# EAGLE design untitled (EAGLE 8.2.2)
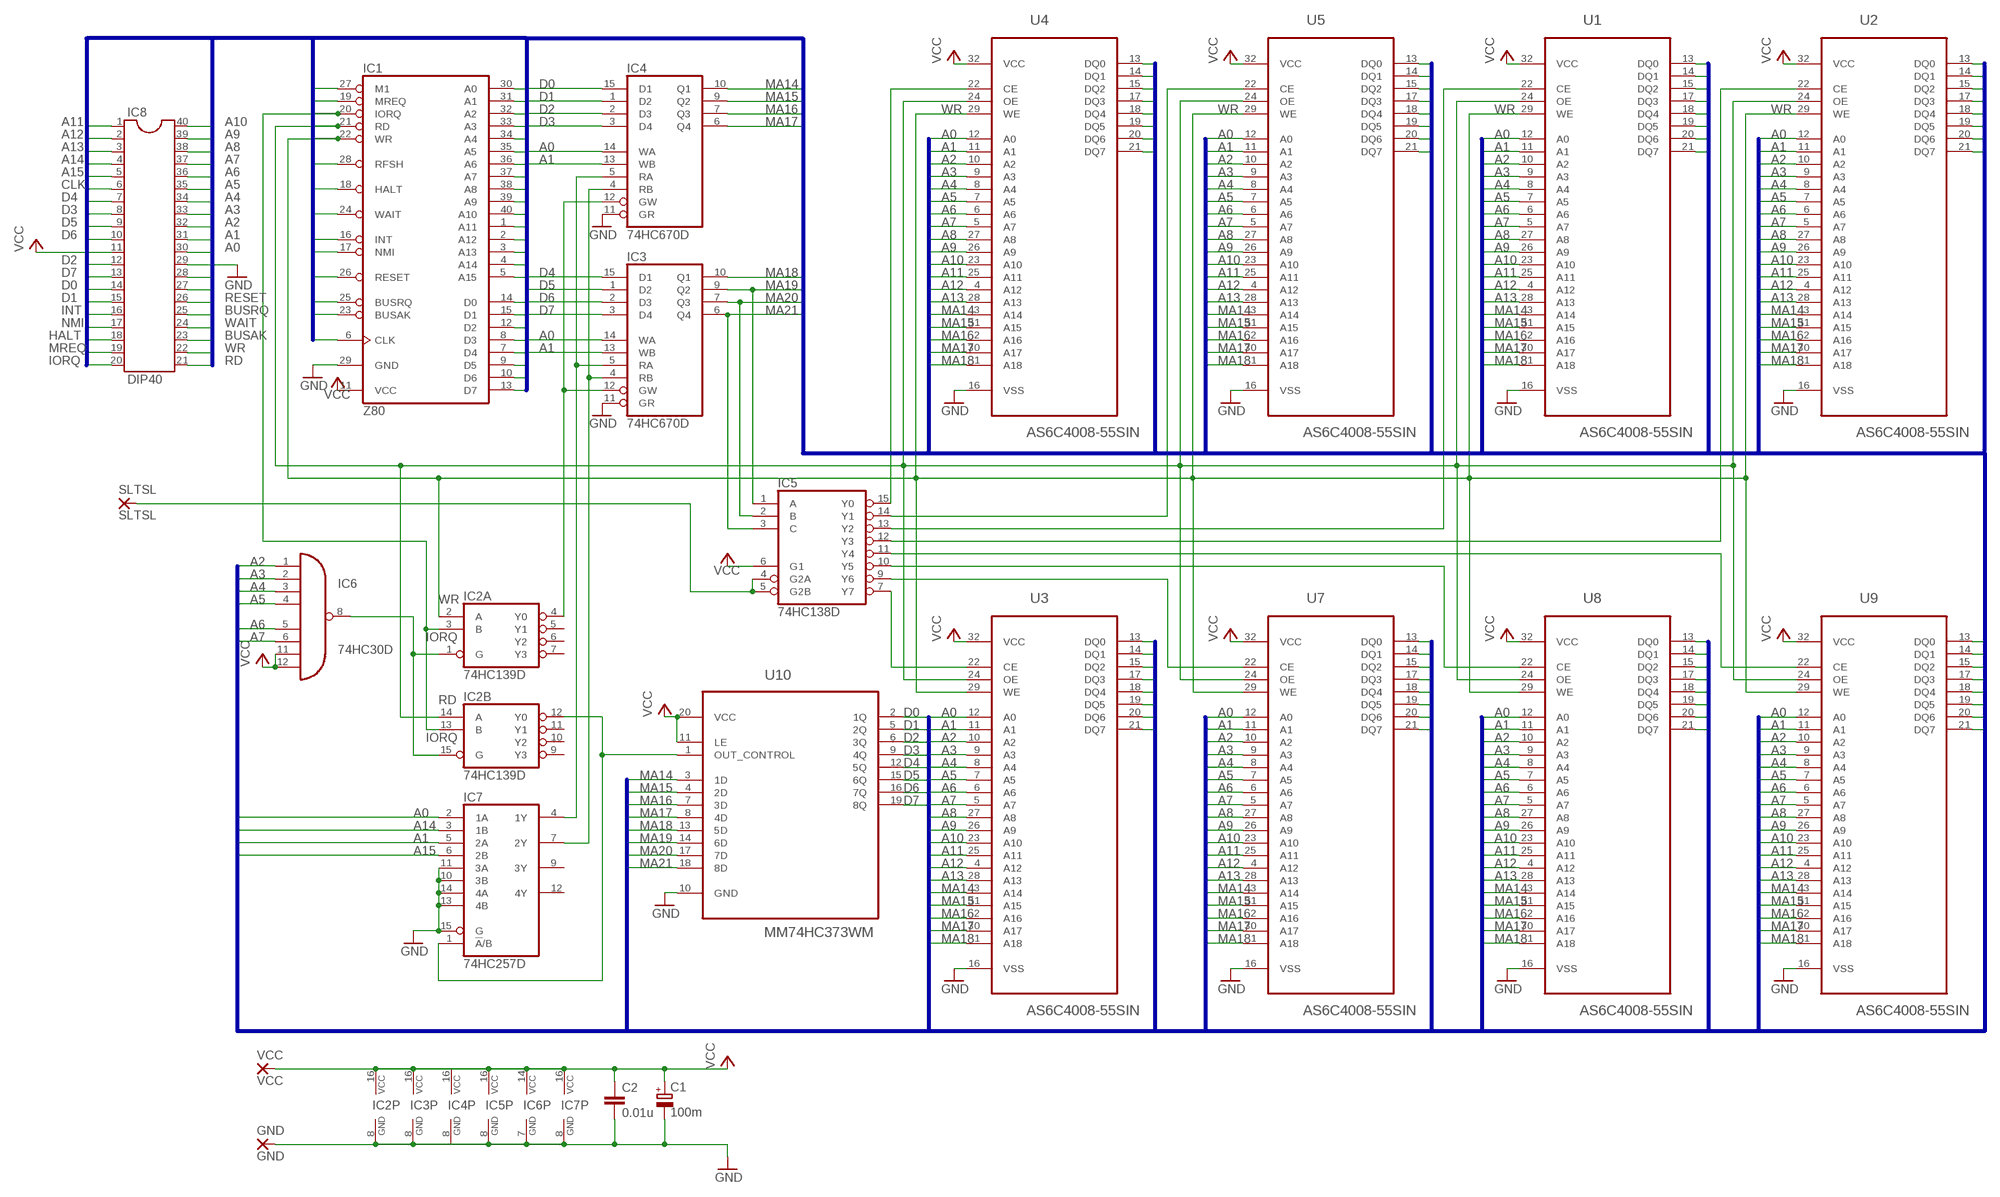
[diagram p0: schematic, sheet 1]

## Parts
C1  100m  CPOL-EUE2.5-5  [E2,5-5]
C2  0.01u  C2.5/2  [C2.5-2]
GND  GND  WIREPAD1,6/0,8  [1,6/0,8]
IC1  Z80  Z80CPU  [DIL40]
IC2  74HC139D  [SO16]
IC3  74HC670D  [SO16]
IC4  74HC670D  [SO16]
IC5  74HC138D  [SO16]
IC6  74HC30D  [SO14]
IC7  74HC257D  [SO16]
IC8  DIP40  DIL40  [DIL40]
SLTSL  SLTSL  WIREPAD1,6/0,8  [1,6/0,8]
U1  AS6C4008-55SIN  [SOIC127P1407X299-32N]
U2  AS6C4008-55SIN  [SOIC127P1407X299-32N]
U3  AS6C4008-55SIN  [SOIC127P1407X299-32N]
U4  AS6C4008-55SIN  [SOIC127P1407X299-32N]
U5  AS6C4008-55SIN  [SOIC127P1407X299-32N]
U7  AS6C4008-55SIN  [SOIC127P1407X299-32N]
U8  AS6C4008-55SIN  [SOIC127P1407X299-32N]
U9  AS6C4008-55SIN  [SOIC127P1407X299-32N]
U10  MM74HC373WM  [SOIC127P1032X265-20N]
VCC  VCC  WIREPAD1,6/0,8  [1,6/0,8]

## Nets
A0: IC1.30(A0) IC3.14(WA) IC4.14(WA) IC7.2(1A) IC8.30 U1.12(A0) U2.12(A0) U3.12(A0) U4.12(A0) U5.12(A0) U7.12(A0) U8.12(A0) U9.12(A0)
A1: IC1.31(A1) IC3.13(WB) IC4.13(WB) IC7.5(2A) IC8.31 U1.11(A1) U2.11(A1) U3.11(A1) U4.11(A1) U5.11(A1) U7.11(A1) U8.11(A1) U9.11(A1)
A2: IC1.32(A2) IC6.1(I0) IC8.32 U1.10(A2) U2.10(A2) U3.10(A2) U4.10(A2) U5.10(A2) U7.10(A2) U8.10(A2) U9.10(A2)
A3: IC1.33(A3) IC6.2(I1) IC8.33 U1.9(A3) U2.9(A3) U3.9(A3) U4.9(A3) U5.9(A3) U7.9(A3) U8.9(A3) U9.9(A3)
A4: IC1.34(A4) IC6.3(I2) IC8.34 U1.8(A4) U2.8(A4) U3.8(A4) U4.8(A4) U5.8(A4) U7.8(A4) U8.8(A4) U9.8(A4)
A5: IC1.35(A5) IC6.4(I3) IC8.35 U1.7(A5) U2.7(A5) U3.7(A5) U4.7(A5) U5.7(A5) U7.7(A5) U8.7(A5) U9.7(A5)
A6: IC1.36(A6) IC6.5(I4) IC8.36 U1.6(A6) U2.6(A6) U3.6(A6) U4.6(A6) U5.6(A6) U7.6(A6) U8.6(A6) U9.6(A6)
A7: IC1.37(A7) IC6.6(I5) IC8.37 U1.5(A7) U2.5(A7) U3.5(A7) U4.5(A7) U5.5(A7) U7.5(A7) U8.5(A7) U9.5(A7)
A8: IC1.38(A8) IC8.38 U1.27(A8) U2.27(A8) U3.27(A8) U4.27(A8) U5.27(A8) U7.27(A8) U8.27(A8) U9.27(A8)
A9: IC1.39(A9) IC8.39 U1.26(A9) U2.26(A9) U3.26(A9) U4.26(A9) U5.26(A9) U7.26(A9) U8.26(A9) U9.26(A9)
A10: IC1.40(A10) IC8.40 U1.23(A10) U2.23(A10) U3.23(A10) U4.23(A10) U5.23(A10) U7.23(A10) U8.23(A10) U9.23(A10)
A11: IC1.1(A11) IC8.1 U1.25(A11) U2.25(A11) U3.25(A11) U4.25(A11) U5.25(A11) U7.25(A11) U8.25(A11) U9.25(A11)
A12: IC1.2(A12) IC8.2 U1.4(A12) U2.4(A12) U3.4(A12) U4.4(A12) U5.4(A12) U7.4(A12) U8.4(A12) U9.4(A12)
A13: IC1.3(A13) IC8.3 U1.28(A13) U2.28(A13) U3.28(A13) U4.28(A13) U5.28(A13) U7.28(A13) U8.28(A13) U9.28(A13)
A14: IC1.4(A14) IC7.3(1B) IC8.4
A15: IC1.5(A15) IC7.6(2B) IC8.5
BUSAK: IC1.23(BUSAK) IC8.23
BUSRQ: IC1.25(BUSRQ) IC8.25
CLK: IC1.6(CLK) IC8.6
D0: IC1.14(D0) IC4.15(D1) IC8.14 U1.13(DQ0) U2.13(DQ0) U3.13(DQ0) U4.13(DQ0) U5.13(DQ0) U7.13(DQ0) U8.13(DQ0) U9.13(DQ0) U10.2(1Q)
D1: IC1.15(D1) IC4.1(D2) IC8.15 U1.14(DQ1) U2.14(DQ1) U3.14(DQ1) U4.14(DQ1) U5.14(DQ1) U7.14(DQ1) U8.14(DQ1) U9.14(DQ1) U10.5(2Q)
D2: IC1.12(D2) IC4.2(D3) IC8.12 U1.15(DQ2) U2.15(DQ2) U3.15(DQ2) U4.15(DQ2) U5.15(DQ2) U7.15(DQ2) U8.15(DQ2) U9.15(DQ2) U10.6(3Q)
D3: IC1.8(D3) IC4.3(D4) IC8.8 U1.17(DQ3) U2.17(DQ3) U3.17(DQ3) U4.17(DQ3) U5.17(DQ3) U7.17(DQ3) U8.17(DQ3) U9.17(DQ3) U10.9(4Q)
D4: IC1.7(D4) IC3.15(D1) IC8.7 U1.18(DQ4) U2.18(DQ4) U3.18(DQ4) U4.18(DQ4) U5.18(DQ4) U7.18(DQ4) U8.18(DQ4) U9.18(DQ4) U10.12(5Q)
D5: IC1.9(D5) IC3.1(D2) IC8.9 U1.19(DQ5) U2.19(DQ5) U3.19(DQ5) U4.19(DQ5) U5.19(DQ5) U7.19(DQ5) U8.19(DQ5) U9.19(DQ5) U10.15(6Q)
D6: IC1.10(D6) IC3.2(D3) IC8.10 U1.20(DQ6) U2.20(DQ6) U3.20(DQ6) U4.20(DQ6) U5.20(DQ6) U7.20(DQ6) U8.20(DQ6) U9.20(DQ6) U10.16(7Q)
D7: IC1.13(D7) IC3.3(D4) IC8.13 U1.21(DQ7) U2.21(DQ7) U3.21(DQ7) U4.21(DQ7) U5.21(DQ7) U7.21(DQ7) U8.21(DQ7) U9.21(DQ7) U10.19(8Q)
GND [vcc]: C1.- C2.2 GND.1(P) IC1.29(GND) IC2.8(P:GND) IC3.8(GND) IC3.11(GR) IC4.8(GND) IC4.11(GR) IC5.8(GND) IC6.7(GND) IC7.8(GND) IC7.10(3B) IC7.11(3A) IC7.13(4B) IC7.14(4A) IC7.15(G) IC8.29 U1.16(VSS) U2.16(VSS) U3.16(VSS) U4.16(VSS) U5.16(VSS) U7.16(VSS) U8.16(VSS) U9.16(VSS) U10.10(GND)
HALT: IC1.18(HALT) IC8.18
INT: IC1.16(INT) IC8.16
IORQ: IC1.20(IORQ) IC2.3(A:B) IC2.13(B:B) IC8.20
M1: IC1.27(M1) IC8.27
MA14: IC4.10(Q1) U1.3(A14) U2.3(A14) U3.3(A14) U4.3(A14) U5.3(A14) U7.3(A14) U8.3(A14) U9.3(A14) U10.3(1D)
MA15: IC4.9(Q2) U1.31(A15) U2.31(A15) U3.31(A15) U4.31(A15) U5.31(A15) U7.31(A15) U8.31(A15) U9.31(A15) U10.4(2D)
MA16: IC4.7(Q3) U1.2(A16) U2.2(A16) U3.2(A16) U4.2(A16) U5.2(A16) U7.2(A16) U8.2(A16) U9.2(A16) U10.7(3D)
MA17: IC4.6(Q4) U1.30(A17) U2.30(A17) U3.30(A17) U4.30(A17) U5.30(A17) U7.30(A17) U8.30(A17) U9.30(A17) U10.8(4D)
MA18: IC3.10(Q1) U1.1(A18) U2.1(A18) U3.1(A18) U4.1(A18) U5.1(A18) U7.1(A18) U8.1(A18) U9.1(A18) U10.13(5D)
MA19: IC3.9(Q2) IC5.1(A) U10.14(6D)
MA20: IC3.7(Q3) IC5.2(B) U10.17(7D)
MA21: IC3.6(Q4) IC5.3(C) U10.18(8D)
MREQ: IC1.19(MREQ) IC8.19
N$1: IC2.12(B:Y0) IC7.1(!A!/B) U10.1(OUT_CONTROL)
N$2: IC5.13(Y2) U1.22(CE)
N$3: IC5.12(Y3) U2.22(CE)
N$4: IC3.5(RA) IC4.5(RA) IC7.4(1Y)
N$5: IC5.15(Y0) U4.22(CE)
N$6: IC5.14(Y1) U5.22(CE)
N$7: IC3.4(RB) IC4.4(RB) IC7.7(2Y)
N$8: IC5.11(Y4) U9.22(CE)
N$9: IC2.1(A:G) IC2.15(B:G) IC6.8(O)
N$10: IC5.10(Y5) U8.22(CE)
N$11: IC5.9(Y6) U7.22(CE)
N$12: IC2.4(A:Y0) IC3.12(GW) IC4.12(GW)
N$13: IC5.4(G2A) IC5.5(G2B) SLTSL.1(P)
N$14: IC5.7(Y7) U3.22(CE)
NMI: IC1.17(NMI) IC8.17
RD: IC1.21(RD) IC2.14(B:A) IC8.21 U1.24(OE) U2.24(OE) U3.24(OE) U4.24(OE) U5.24(OE) U7.24(OE) U8.24(OE) U9.24(OE)
RESET: IC1.26(RESET) IC8.26
RFSH: IC1.28(RFSH) IC8.28
VCC [vcc]: C1.+ C2.1 IC1.11(VCC) IC2.16(P:VCC) IC3.16(VCC) IC4.16(VCC) IC5.6(G1) IC5.16(VCC) IC6.11(I6) IC6.12(I7) IC6.14(VCC) IC7.16(VCC) IC8.11 U1.32(VCC) U2.32(VCC) U3.32(VCC) U4.32(VCC) U5.32(VCC) U7.32(VCC) U8.32(VCC) U9.32(VCC) U10.11(LE) U10.20(VCC) VCC.1(P)
WAIT: IC1.24(WAIT) IC8.24
WR: IC1.22(WR) IC2.2(A:A) IC8.22 U1.29(WE) U2.29(WE) U3.29(WE) U4.29(WE) U5.29(WE) U7.29(WE) U8.29(WE) U9.29(WE)
Unconnected: IC2.5(A:Y1) IC2.6(A:Y2) IC2.7(A:Y3) IC2.9(B:Y3) IC2.10(B:Y2) IC2.11(B:Y1) IC7.9(3Y) IC7.12(4Y)

## Buses
B$2,A[0..15],MA[14..21],D[0..7],M1,MREQ,IORQ,RD,WR,RFSH,HALT,WAIT,INT,NMI,RESET,BUSRQ,BUSAK,CLK

## Library data of the parts
C1 = resistor:CPOL-EU: POLARIZED CAPACITOR, European symbol
C2 = capacitor-wima:C: CAPACITOR naming: grid - package width
GND SLTSL VCC = wirepad:WIREPAD: Wire PAD connect wire on PCB
IC1 = zilog:Z80CPU: Z80 FAMILY DEVICE
IC2 = 74xx-eu:74*139: Dual 2-line to 4-line DECODER/DEMULTIPLEXER
IC3 IC4 = 74xx-eu:74*670: 4 by 4 REGISTER FILES, 3-state
IC5 = 74xx-eu:74*138: 3-line to 8-line DECODER/DEMULTIPLEXER
IC6 = 74xx-eu:74*30: 8-input NAND gate
IC7 = 74xx-eu:74*257: Quadruple 2-to 1 line data SELECTOR/MULTIPLEXER
IC8 = ic-package:DIL40: Dual In Line
U1-U5 U7-U9 = Alliance_Memory_By_element14_Batch_1:AS6C4008-55SIN: CMOS SRAM; MPN: AS6C4008-55SIN; OC_FARNELL: 1562901; OC_NEWARK: 94M6218; PACKAGE: SO-32; SUPPLIER: ALLIANCE MEMORY
U10 = Fairchild_By_element14_Batch_1:MM74HC373WM: 3-STATE Octal D-Type Latch; MPN: MM74HC373WM; OC_FARNELL: 1013976; OC_NEWARK: 78K6072; PACKAGE: SOIC-20; SUPPLIER: Fairchild

## Net classes
1 vcc: width 0.6 mm

## Board
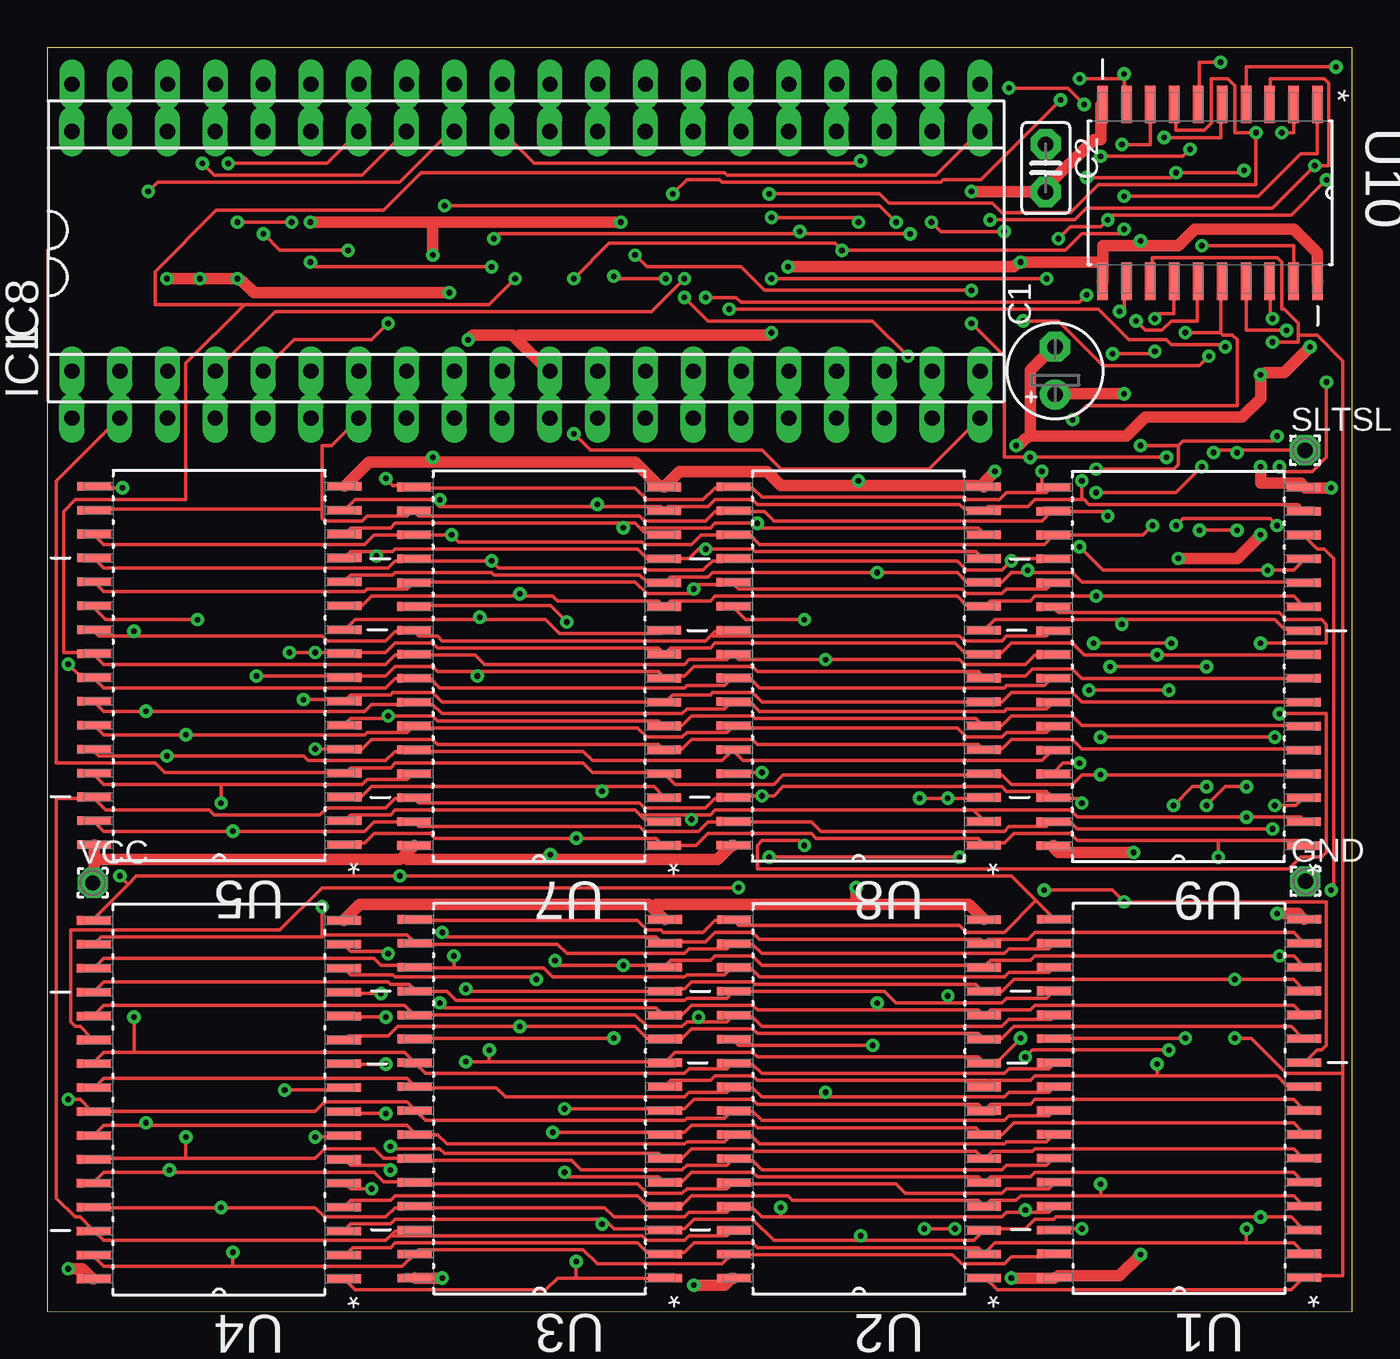
[diagram p1: board, top side]
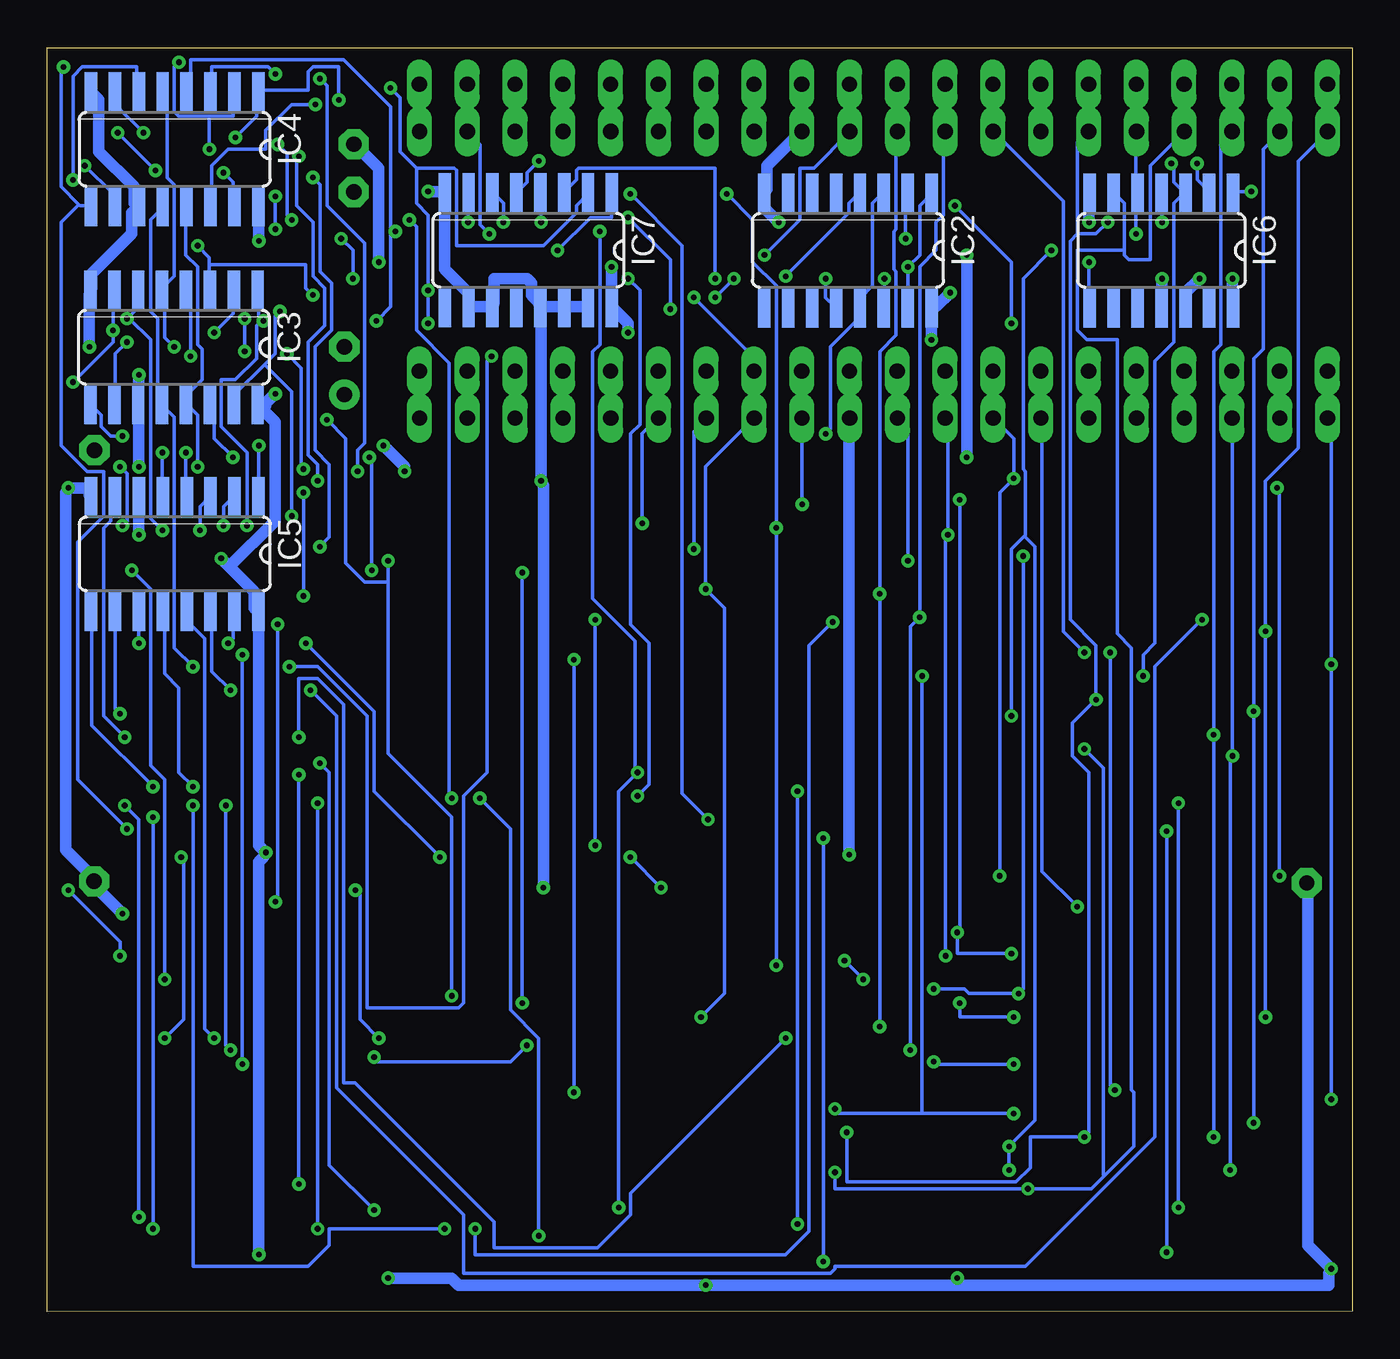
[diagram p2: board, bottom side, seen from below]

Size 69.38 x 67.19 mm. Coordinates in mm from the lower left corner, seen from the top.
Outline: 0.01,0.04 69.38,0 69.36,67.19 0,67.19 0.01,0.04
Copper layers (1*16): Top 0.035mm / dielectric 1.5mm / Bottom 0.035mm
Design rules "default *": minimum track width 7mil, minimum drill 0.3mm, track to track 7mil, track to pad 7mil, pad to pad 7mil, via to via 7mil, smd to smd 7mil, copper to edge 0.4mm, drill to drill 8mil, minimum pad ring 10mil, minimum via ring 8mil, stop-mask expansion 4mil, vias tented up to drill 0mil, thermal gap 10mil

### Footprints (pad centres in the part's own frame; a part is rotated, then mirrored left to right if it is on the bottom)
E2,5-5 = drill 0.813 pad 1.6: + -1.27,0 | drill 0.813 pad 1.6 octagon: - 1.27,0
C2.5-2 = drill 0.813 pad 1.6 octagon: 1 -1.27,0; 2 1.27,0
1,6/0,8 = drill 0.813 pad 1.6 octagon: 1 0,0
DIL40 = drill 0.813 long: 1 -24.13,-7.62; 2 -21.59,-7.62; 3 -19.05,-7.62; 4 -16.51,-7.62; 5 -13.97,-7.62; 6 -11.43,-7.62; 7 -8.89,-7.62; 8 -6.35,-7.62; 9 -3.81,-7.62; 10 -1.27,-7.62; 11 1.27,-7.62; 12 3.81,-7.62; 13 6.35,-7.62; 14 8.89,-7.62; 15 11.43,-7.62; 16 13.97,-7.62; 17 16.51,-7.62; 18 19.05,-7.62; 19 21.59,-7.62; 20 24.13,-7.62; 21 24.13,7.62; 22 21.59,7.62; 23 19.05,7.62; 24 16.51,7.62; 25 13.97,7.62; 26 11.43,7.62; 27 8.89,7.62; 28 6.35,7.62; 29 3.81,7.62; 30 1.27,7.62; 31 -1.27,7.62; 32 -3.81,7.62; 33 -6.35,7.62; 34 -8.89,7.62; 35 -11.43,7.62; 36 -13.97,7.62; 37 -16.51,7.62; 38 -19.05,7.62; 39 -21.59,7.62; 40 -24.13,7.62
SO16 = smd 0.66 x 2.032: 1 -4.445,-3.073; 2 -3.175,-3.073; 3 -1.905,-3.073; 4 -0.635,-3.073; 5 0.635,-3.073; 6 1.905,-3.073; 7 3.175,-3.073; 8 4.445,-3.073; 9 4.445,3.073; 10 3.175,3.073; 11 1.905,3.073; 12 0.635,3.073; 13 -0.635,3.073; 14 -1.905,3.073; 15 -3.175,3.073; 16 -4.445,3.073
SO14 = smd 0.66 x 2.032: 1 -3.81,-3.073; 2 -2.54,-3.073; 3 -1.27,-3.073; 4 0,-3.073; 5 1.27,-3.073; 6 2.54,-3.073; 7 3.81,-3.073; 8 3.81,3.073; 9 2.54,3.073; 10 1.27,3.073; 11 0,3.073; 12 -1.27,3.073; 13 -2.54,3.073; 14 -3.81,3.073
SOIC127P1407X299-32N = smd 1.803 x 0.457: 1 -6.655,9.525; 2 -6.655,8.255; 3 -6.655,6.985; 4 -6.655,5.715; 5 -6.655,4.445; 6 -6.655,3.175; 7 -6.655,1.905; 8 -6.655,0.635; 9 -6.655,-0.635; 10 -6.655,-1.905; 11 -6.655,-3.175; 12 -6.655,-4.445; 13 -6.655,-5.715; 14 -6.655,-6.985; 15 -6.655,-8.255; 16 -6.655,-9.525; 17 6.655,-9.525; 18 6.655,-8.255; 19 6.655,-6.985; 20 6.655,-5.715; 21 6.655,-4.445; 22 6.655,-3.175; 23 6.655,-1.905; 24 6.655,-0.635; 25 6.655,0.635; 26 6.655,1.905; 27 6.655,3.175; 28 6.655,4.445; 29 6.655,5.715; 30 6.655,6.985; 31 6.655,8.255; 32 6.655,9.525
SOIC127P1032X265-20N = smd 1.981 x 0.559: 1 -4.699,5.715; 2 -4.699,4.445; 3 -4.699,3.175; 4 -4.699,1.905; 5 -4.699,0.635; 6 -4.699,-0.635; 7 -4.699,-1.905; 8 -4.699,-3.175; 9 -4.699,-4.445; 10 -4.699,-5.715; 11 4.699,-5.715; 12 4.699,-4.445; 13 4.699,-3.175; 14 4.699,-1.905; 15 4.699,-0.635; 16 4.699,0.635; 17 4.699,1.905; 18 4.699,3.175; 19 4.699,4.445; 20 4.699,5.715

### Placement (x,y rotation side)
C1  53.58,50.02 90 top
C2  53.08,60.79 270 top
GND  66.88,22.88 0 top
IC1  25.45,55.12 0 top
IC2  26.81,56.41 180 bottom
IC3  62.63,51.26 180 bottom
IC4  62.6,61.78 180 bottom
IC5  62.59,40.28 180 bottom
IC6  10.15,56.41 180 bottom
IC7  43.8,56.42 180 bottom
IC8  25.46,57.62 0 top
SLTSL  66.86,45.79 0 top
U1  60.17,11.34 180 top
U2  43.15,11.32 180 top
U3  26.18,11.33 180 top
U4  9.14,11.28 180 top
U5  9.15,34.35 180 top
U7  26.15,34.31 180 top
U8  43.13,34.32 180 top
U9  60.13,34.3 180 top
U10  61.81,59.47 270 top
VCC  2.43,22.79 0 top

### Tracks (layer width: path | path; a pad name or v marks a point on that pad's centre or on a via)
A0  (via drill 0.3)
  Top 0.178: U1.12 66.75,15.79 66.25,16.29 52.5,16.29 52.25,16.04 50.12,16.04 49.88,15.79 U2.12 49.75,15.79 49.5,16.04 44.12,16.04 | v18,15.66 15.88,15.66 U4.12 | v20.88,16.41 21.12,16.16 32.38,16.16 32.75,15.79 U3.12 32.88,15.79 33.75,15.79 34.25,16.29 37.5,16.29 37.75,16.04 44.12,16.04 | IC1.30 26.75,62.79 26.75,65.16 IC8.30 | 52.12,39.29 51.25,39.29 50.75,38.79 49.88,38.79 U8.12 49.75,38.79 48.88,38.79 48.38,39.29 v44.12,39.29 35.38,39.29 35.12,39.04 33.12,39.04 32.88,38.79 U7.12 32.75,38.79 31.88,38.79 31.5,39.16 23.75,39.16 23.62,39.29 18.5,39.29 18.38,39.16 16.12,39.16 15.88,38.91 U5.12 | 52.12,39.29 54.5,39.29 55,38.79 66.75,38.79 U9.12 | v59.5,45.41 v52.25,45.41 50.88,45.41 50.88,50.79 v49.12,52.54 | 52.12,39.29 v52.12,39.41 | v55.12,64.16 54.25,65.04 v51.12,65.04 | v31.25,56.16 31.88,55.54 36.88,55.54 38.12,54.29 v49.12,54.29 | v44.12,16.41 44.12,16.04
  Bottom 0.178: v18,15.66 20.88,15.66 v20.88,16.41 | v59.5,45.41 60.5,46.41 60.5,48.04 60.62,48.16 IC3.14 | v52.25,45.41 52.12,45.29 v52.12,39.41 | 49.75,60.79 47.75,60.79 47.62,60.66 47.62,56.66 43,56.66 41.25,58.41 41.25,58.79 40.62,59.41 IC7.2 | 49.75,60.79 49.75,58.91 49.12,58.29 v49.12,54.29 v49.12,52.54 | v55.12,64.16 56.38,64.16 57.75,62.79 57.75,61.79 59.75,61.79 60.62,60.91 60.62,58.79 IC4.14 | v51.12,65.04 50.62,64.54 50.62,61.66 49.75,60.79 | v31.25,56.16 29.38,58.04 29.38,60.79 28.62,60.79 26.75,62.66 IC1.30 | v44.12,39.29 v44.12,16.41
A1  (via drill 0.3)
  Top 0.178: U4.11 15.88,14.54 16,14.66 18.12,14.66 18.62,15.16 v25.12,15.16 31.25,15.16 31.88,14.54 32.75,14.54 U3.11 32.88,14.54 33.75,14.54 34.25,15.04 37.5,15.04 37.75,14.79 49.5,14.79 49.75,14.54 U2.11 49.88,14.54 50.75,14.54 51.38,15.16 66.12,15.16 66.75,14.54 U1.11 | v43.25,61.16 43.12,61.04 25.88,61.04 24.25,62.66 IC1.31 24.25,62.79 24.25,65.16 IC8.31 | 25.12,38.04 17.25,38.04 16.75,37.54 15.88,37.54 U5.11 | 25.12,38.04 26.88,38.04 27.12,37.79 32.5,37.79 32.75,37.54 U7.11 32.88,37.54 33.12,37.79 35.25,37.79 35.5,38.04 48.38,38.04 48.88,37.54 49.75,37.54 U8.11 49.88,37.54 50.12,37.79 52.25,37.79 52.5,38.04 v55.75,38.04 66.25,38.04 66.75,37.54 U9.11 | v61.38,44.91 60,43.54 v55.75,43.54 | 25.12,38.04 v25.12,38.16
  Bottom 0.178: v43.25,61.16 43.88,60.54 43.88,60.04 44.38,59.54 IC7.5 | IC4.13 62,58.66 62,56.16 61.38,55.54 61.38,51.41 61.12,51.16 61.12,49.54 61.88,48.79 61.88,48.29 IC3.13 61.88,48.16 61.38,47.66 v61.38,44.91 | v55.75,38.04 v55.75,43.54 | IC1.31 24.25,62.66 24.25,57.54 24.38,57.41 24.38,55.41 24.25,55.29 24.25,51.91 25.12,51.04 v25.12,38.16 v25.12,15.16
A2  (via drill 0.3)
  Top 0.178: 57.12,36.79 65.25,36.79 65.75,36.29 66.75,36.29 U9.10 | 57.12,36.79 50.38,36.79 49.88,36.29 U8.10 | 57.12,36.79 v57.12,36.54 | U1.10 66.88,13.29 67.5,13.91 67.75,13.91 68,14.16 68,21.79 v57.25,21.79 56.62,22.41 v53,22.41 | v18,13.16 15.88,13.16 U4.10 | 23.5,13.29 32.75,13.29 U3.10 32.88,13.29 33.38,13.79 37.5,13.79 37.75,13.54 49.5,13.54 49.75,13.29 U2.10 49.88,13.29 50.5,13.29 v51.75,14.54 | 23.5,13.29 v22.25,13.29 | 23,36.79 26.5,36.79 27.25,36.04 32.62,36.04 32.75,36.16 U7.10 | 23,36.79 16.38,36.79 15.88,36.29 U5.10 | v5.38,59.54 5.88,60.04 18.75,60.04 21.38,62.66 21.62,62.66 IC1.32 21.62,62.79 21.62,65.16 IC8.32 | v23,36.91 23,36.79 | v23.5,13.91 23.5,13.29
  Bottom 0.178: v57.25,21.79 57.12,21.91 v57.12,36.54 | v18,13.16 22.25,13.16 v22.25,13.29 | v5.38,59.54 6.25,59.54 IC6.1 | IC1.32 21.75,62.66 21.75,58.29 22.12,57.91 22.12,56.41 23,55.54 v23,36.91 23.5,36.41 v23.5,13.91 | v53,22.41 52.75,22.16 52.75,15.54 v51.75,14.54
A3  (via drill 0.3)
  Top 0.178: 50.06,12.23 50.12,12.29 52.25,12.29 52.5,12.54 59,12.54 | 50.06,12.23 49.88,12.04 U2.9 | 59,12.54 65.38,12.54 65.88,12.04 66.75,12.04 U1.9 | U3.9 32.88,12.04 33.12,12.29 35.25,12.29 35.5,12.54 37.5,12.54 37.75,12.29 50,12.29 50.06,12.23 | U9.9 66.75,34.91 v59,34.91 55.12,34.91 54.5,35.54 51.25,35.54 50.75,35.04 49.88,35.04 U8.9 49.75,35.04 48.75,35.04 48.25,35.54 35.5,35.54 35.25,35.29 33.12,35.29 32.88,35.04 U7.9 32.75,35.04 32.5,35.29 20.75,35.29 20.5,35.54 18.5,35.54 18,35.04 15.88,35.04 U5.9 15.75,35.04 v14.25,35.04 v12.88,35.04 | v8.25,61.04 8.88,60.41 16.75,60.41 19,62.66 IC1.33 19.12,62.79 19.12,65.16 IC8.33 | v12.62,11.79 15.62,11.79 15.75,11.91 U4.9 | v59,13.16 59,12.54
  Bottom 0.178: v8.25,61.04 8.25,60.16 7.62,59.54 IC6.2 | v12.62,11.79 12.88,12.04 v12.88,35.04 | v14.25,35.04 15.38,36.16 15.38,59.04 19,62.66 IC1.33 | v59,34.91 v59,13.16
A4  (via drill 0.3)
  Top 0.178: U1.8 66.75,10.79 66.25,11.29 52.5,11.29 52.25,11.04 50.12,11.04 49.88,10.79 U2.8 49.75,10.79 49.5,11.04 37.75,11.04 37.5,11.29 34.38,11.29 33.88,10.79 32.88,10.79 U3.8 32.75,10.79 v27.5,10.79 | v18,10.54 15.88,10.54 U4.8 | U9.8 55,33.66 54.5,34.16 52.38,34.16 52,33.79 49.88,33.79 U8.8 49.75,33.79 49.5,34.04 37.75,34.04 37.5,34.29 34.38,34.29 33.88,33.79 32.88,33.79 U7.8 32.75,33.79 32.5,34.04 22.88,34.04 | v9.62,61.04 14.88,61.04 16.5,62.66 IC1.34 16.62,62.79 16.62,65.16 IC8.34 | 22.88,34.04 20.75,34.04 20.5,34.29 18.5,34.29 18,33.79 15.88,33.79 U5.8 15.75,33.79 v11.12,33.79 | 22.88,34.04 v22.88,33.79
  Bottom 0.178: 22.88,10.54 27.5,10.54 v27.5,10.79 | 22.88,10.54 v18,10.54 | v9.62,61.04 9.5,60.91 9.5,60.04 9,59.54 IC6.3 9,59.41 9.5,58.91 9.5,51.54 10.5,50.54 10.5,35.54 11.12,34.91 v11.12,33.79 | v22.88,33.79 22.88,10.54
A5  (via drill 0.3)
  Top 0.178: v14.25,9.29 15.75,9.29 U4.7 | v26.88,9.54 32.75,9.54 U3.7 32.88,9.54 33.88,9.54 34.25,9.91 37.62,9.91 37.75,9.79 49.38,9.79 49.75,9.41 U2.7 50.75,9.41 51.38,10.04 66.25,10.04 66.75,9.54 U1.7 | v13,57.91 v10.12,57.91 | IC8.35 14,65.16 14,62.79 IC1.35 | U9.7 66.75,32.41 55,32.41 54.5,32.91 51.25,32.91 50.75,32.41 U8.7 38,32.41 37.5,32.91 35.38,32.91 35.25,32.79 33.25,32.79 32.88,32.41 U7.7 32.75,32.41 21,32.41 20.5,32.91 18.38,32.91 18.25,32.79 16.12,32.79 15.88,32.54 U5.7 15.75,32.54 v13.62,32.54
  Bottom 0.178: v26.88,9.54 26.88,6.91 17.88,6.91 17.12,7.66 17.12,9.29 v14.25,9.29 14,9.54 14,28.66 14.88,29.54 14.88,31.29 v13.62,32.54 13.62,35.41 15,36.79 15,56.91 14.62,57.29 | v10.12,57.91 10.12,59.41 IC6.4 | v13,57.91 13.62,57.29 14.62,57.29 | 14.62,57.29 14.62,62.16 14.12,62.66 IC1.35
A6  (via drill 0.3)
  Top 0.178: U1.6 66.75,8.16 66.25,8.66 52.5,8.66 52.38,8.54 50.25,8.54 49.88,8.16 U2.6 49.75,8.16 49.38,8.54 37.62,8.54 37.5,8.66 34.25,8.66 33.75,8.16 32.88,8.16 U3.6 32.75,8.16 32.5,8.41 21.12,8.41 20.88,8.66 18.38,8.66 v18.25,8.79 | v18.25,7.54 18,7.79 16.12,7.79 15.88,8.04 U4.6 | IC8.36 11.5,65.16 11.5,62.79 IC1.36 | 18.12,31.54 18.38,31.54 18.5,31.66 20.5,31.66 20.75,31.41 32.5,31.41 32.75,31.16 U7.6 32.88,31.16 33.75,31.16 34.25,31.66 37.5,31.66 37.62,31.54 49.38,31.54 49.75,31.16 U8.6 49.88,31.16 50.75,31.16 51.25,31.66 54.5,31.66 55,31.16 66.75,31.16 U9.6 | 18.12,31.54 16.12,31.54 15.88,31.29 U5.6 | v11.5,57.29 12.38,56.41 v16,56.41 | 18.12,31.54 v18.12,31.66
  Bottom 0.178: v18.25,7.54 v18.25,8.79 16.88,10.16 16.88,40.66 17.44,41.23 | IC1.36 11.5,62.66 11.5,59.54 IC6.5 11.5,59.41 v11.5,57.29 | v16,56.41 17.5,54.91 17.5,44.79 17.38,44.66 17.38,41.29 17.44,41.23 | 17.44,41.23 18.12,40.54 v18.12,31.66
A7  (via drill 0.3)
  Top 0.178: U9.5 66.75,29.91 55,29.91 54.5,30.41 51.25,30.41 50.75,29.91 49.88,29.91 U8.5 49.75,29.91 49.5,30.16 37.75,30.16 37.5,30.41 34.25,30.41 33.75,29.91 32.88,29.91 U7.5 32.75,29.91 32.5,30.16 20.75,30.16 20.5,30.41 17.25,30.41 16.75,29.91 15.88,29.91 U5.5 15.75,29.91 v14.25,29.91 | U1.5 66.75,6.91 66.25,7.41 52.5,7.41 52.25,7.16 50.12,7.16 49.88,6.91 U2.5 49.75,6.91 49.5,7.16 37.75,7.16 37.5,7.41 34.25,7.41 33.75,6.91 32.88,6.91 U3.5 32.75,6.91 32.5,7.16 27.75,7.16 v27.5,7.41 | IC8.37 9,65.16 9,62.79 IC1.37 | v17.25,6.54 16.12,6.54 15.88,6.79 U4.5
  Bottom 0.178: 12.12,56.41 12.12,56.16 11.88,55.91 10.75,55.91 10.75,60.91 9,62.66 IC1.37 | 12.12,56.41 12.12,58.91 12.62,59.41 IC6.6 | v27.5,7.41 27.5,6.54 v17.25,6.54 13.88,6.54 13.19,7.23 | 12.12,56.41 14.62,56.41 14.62,52.16 14.12,51.66 12.5,51.66 12.5,36.04 11.75,35.29 11.75,11.79 11.62,11.66 11.62,8.79 13.19,7.23 | v14.25,29.91 13.25,28.91 13.25,7.29 13.19,7.23
A8  (via drill 0.3)
  Top 0.178: 7.38,8.16 14.25,8.16 14.75,8.66 17.38,8.66 17.88,8.16 19.5,8.16 U3.27 19.62,8.04 27.88,8.04 28.38,7.54 33.75,7.54 34,7.79 36.12,7.79 36.38,8.04 U2.27 36.5,8.04 37.5,8.04 38,7.54 50.75,7.54 51,7.79 53.12,7.79 53.5,8.16 U1.27 | 7.38,8.16 2.5,8.16 U4.27 | U9.27 53.38,31.04 53.12,30.79 51,30.79 50.75,30.54 48.88,30.54 48.38,31.04 36.5,31.04 U8.27 36.38,31.04 36.12,30.79 34,30.79 33.75,30.54 31.88,30.54 31.38,31.04 19.5,31.04 U7.27 19.38,31.04 19.12,30.79 17,30.79 16.88,30.66 v7.38,30.66 3,30.66 2.5,31.16 U5.27 | IC1.38 6.38,62.79 6.38,65.16 IC8.38 | v7.38,9.29 7.38,8.16
  Bottom 0.178: IC1.38 6.5,62.66 7,62.16 7,51.41 7.38,51.04 v7.38,30.66 v7.38,9.29
A9  (via drill 0.3)
  Top 0.178: 5.25,9.91 19.12,9.91 19.5,9.54 U3.26 19.62,9.41 20.75,9.41 21.25,8.91 33.88,8.91 34,9.04 36,9.04 36.38,9.41 U2.26 37.38,9.41 37.88,8.91 50.88,8.91 51,9.04 53.12,9.04 53.5,9.41 U1.26 | 5.25,9.91 3,9.91 2.5,9.41 U4.26 | U9.26 53.38,32.29 53.12,32.04 51,32.04 50.88,31.91 37.88,31.91 37.38,32.41 U8.26 36.38,32.41 36,32.04 34,32.04 33.75,31.79 21,31.79 20.5,32.29 19.5,32.29 U7.26 19.38,32.29 17.25,32.29 16.88,31.91 v5.25,31.91 3,31.91 2.5,32.41 U5.26 | IC1.39 3.88,62.79 3.88,65.16 IC8.39 | v5.25,10.04 5.25,9.91
  Bottom 0.178: IC1.39 3.88,62.66 4.75,61.79 4.75,51.16 5.25,50.66 v5.25,31.91 v5.25,10.04
A10  (via drill 0.3)
  Top 0.178: 4.62,13.79 19,13.79 19.5,13.29 U3.23 19.62,13.16 20.12,12.66 33.88,12.66 34.12,12.91 36.12,12.91 36.38,13.16 U2.23 36.5,13.16 37.5,13.16 38,12.66 50.88,12.66 51.12,12.91 53.25,12.91 53.5,13.16 U1.23 | 4.62,13.79 3,13.79 2.5,13.29 U4.23 | IC1.40 1.38,62.79 1.38,65.16 IC8.40 | 35.31,35.98 35.5,36.16 36.38,36.16 U8.23 | 35.31,35.98 35,35.66 21,35.66 20.75,35.91 19.75,35.91 19.5,36.16 U7.23 19.38,36.16 18.5,36.16 18,35.66 14.88,35.66 14.62,35.91 4.62,35.91 | 4.62,35.91 2.75,35.91 2.5,36.16 U5.23 | U9.23 53.38,36.16 53.12,35.91 51,35.91 50.75,35.66 48.75,35.66 48.5,35.91 35.38,35.91 35.31,35.98 | 4.62,35.91 v4.62,36.16 | v4.62,15.66 4.62,13.79
  Bottom 0.178: IC1.40 1.38,62.66 2.88,61.16 2.88,45.91 4.62,44.16 v4.62,36.16 v4.62,15.66
A11  (via drill 0.3)
  Top 0.178: U1.25 53.5,10.66 53.25,10.41 51.12,10.41 50.88,10.16 38,10.16 37.5,10.66 36.5,10.66 U2.25 36.38,10.66 36,10.29 34,10.29 33.88,10.16 20.12,10.16 19.62,10.66 U3.25 19.5,10.79 19.12,11.16 14.75,11.16 14.25,10.66 2.5,10.66 U4.25 2.38,10.66 1.75,11.29 v1.12,11.29 | IC1.1 1.38,47.54 1.38,49.91 IC8.1 | U9.25 53.38,33.66 53,33.29 51,33.29 50.88,33.16 37.88,33.16 37.38,33.66 36.5,33.66 U8.25 36.38,33.66 36,33.29 34,33.29 33.88,33.16 20.88,33.16 20.38,33.66 19.5,33.66 U7.25 19.38,33.66 18.5,33.66 18,33.16 3,33.16 2.5,33.66 U5.25 2.38,33.79 1.75,33.79 v1.12,34.41
  Bottom 0.178: IC1.1 1.25,47.41 1.12,47.29 v1.12,34.41 v1.12,11.29
A12  (via drill 0.3)
  Top 0.178: 56,6.16 66.25,6.16 66.75,5.66 U1.4 | 56,6.16 51.75,6.16 51.5,5.91 50.12,5.91 49.88,5.66 U2.4 49.75,5.66 49.5,5.91 39.62,5.91 39.38,6.16 34.25,6.16 33.75,5.66 32.88,5.66 U3.4 32.75,5.66 31.88,5.66 31.38,6.16 18.5,6.16 18.25,5.91 16.12,5.91 15.88,5.66 U4.4 | IC8.2 3.88,49.91 3.88,47.54 IC1.2 3.75,47.41 0.5,44.16 0.5,29.16 5.75,29.16 6.25,28.66 15.75,28.66 U5.4 15.88,28.66 16.12,28.91 18.25,28.91 18.5,29.16 28.5,29.16 29,28.66 32.75,28.66 U7.4 32.88,28.54 33.38,28.04 38.62,28.04 39.12,28.54 49.75,28.54 U8.4 49.88,28.54 50.75,28.54 51.25,28.04 54.5,28.04 55,28.54 v56,28.54 66.75,28.54 U9.4 | v56,6.79 56,6.16
  Bottom 0.178: v56,28.54 v56,6.79
A13  (via drill 0.3)
  Top 0.178: 6.5,7.41 17.38,7.41 17.88,6.91 19.5,6.91 U3.28 19.62,6.79 31.38,6.79 31.88,6.29 33.75,6.29 34,6.54 36.12,6.54 36.38,6.79 U2.28 36.5,6.79 45.12,6.79 45.62,6.29 50.75,6.29 51,6.54 53.25,6.54 53.5,6.79 U1.28 | 6.5,7.41 3,7.41 2.5,6.91 U4.28 | U9.28 53.38,29.79 52.88,29.29 37,29.29 36.5,29.79 U8.28 36.38,29.79 35.88,29.29 29,29.29 28.5,29.79 19.5,29.79 U7.28 19.38,29.79 18.5,29.79 18,29.29 13.88,29.29 13.62,29.54 v6.38,29.54 2.75,29.54 2.5,29.79 U5.28 | IC1.3 6.38,47.54 6.38,49.91 IC8.3 | v6.5,7.54 6.5,7.41
  Bottom 0.178: IC1.3 6.38,47.41 v6.38,29.54 6.5,29.41 v6.5,7.54
A14  (via drill 0.3)
  Top 0.178: v33.88,54.91 32.12,53.16 12.12,53.16 9,50.04 IC8.4 9,49.91 9,47.54 IC1.4
  Bottom 0.178: v33.88,54.91 33.88,60.79 41.12,60.79 41.25,60.66 41.25,60.16 41.88,59.54 IC7.3
A15  (via drill 0.3)
  Top 0.178: v45.12,57.91 44.25,58.79 v21.12,58.79 | v18.12,52.54 17.25,51.66 13.12,51.66 11.5,50.04 IC8.5 11.5,49.91 11.5,47.54 IC1.5
  Bottom 0.178: v45.12,57.91 45.12,58.91 45.62,59.41 IC7.6 | v21.12,58.79 18.12,55.79 v18.12,52.54
BUSAK
  Top 0.178: IC1.23 44.5,65.16 IC8.23
BUSRQ
  Top 0.178: IC1.25 39.5,62.79 39.5,65.16 IC8.25
CLK
  Top 0.178: IC1.6 14,47.54 14,49.91 IC8.6
D0  (via drill 0.3)
  Top 0.178: IC1.14 34.38,47.54 34.38,49.91 IC8.14 | 17.5,40.41 18.38,40.41 18.5,40.54 31.38,40.54 31.88,40.04 32.75,40.04 U7.13 32.88,40.04 34.12,40.04 34.62,40.54 v35,40.54 37.5,40.54 37.62,40.41 49.38,40.41 49.75,40.04 U8.13 | 17.5,40.41 16.12,40.41 15.88,40.16 U5.13 | v65.62,62.66 66.25,62.66 U10.2 | v63.62,60.66 63.5,60.54 v60,60.54 59.75,60.29 v55.25,60.29 | v17.75,16.91 15.88,16.91 U4.13 | v22.25,17.16 22.38,17.04 32.75,17.04 U3.13 32.88,17.16 33.88,17.16 34.25,17.54 37.5,17.54 37.62,17.41 49.38,17.41 49.75,17.04 U2.13 49.88,17.04 50.75,17.04 51.38,17.66 v63.12,17.66 66.25,17.66 66.75,17.16 U1.13 | U9.13 66.75,39.91 66.25,39.41 v64.88,39.41 56.12,39.41 v54.88,40.66 | v17.5,40.16 17.5,40.41
  Bottom 0.178: v35,40.54 35,46.79 34.38,47.41 IC1.14 | v63.62,60.66 v65.62,62.66 | v60,60.54 59.5,60.04 59.5,58.79 IC4.15 | v22.25,17.16 20.62,17.16 20.38,16.91 v17.75,16.91 17.5,17.16 v17.5,40.16 | v64.88,39.41 63.88,38.41 63.88,29.04 63.12,28.29 v63.12,17.66 | v55.25,60.29 54.88,59.91 54.88,55.29 54.25,54.66 54.25,52.16 55.12,51.29 55.12,45.79 54.38,45.04 54.38,41.16 v54.88,40.66
D1  (via drill 0.3)
  Top 0.178: v59.38,62.41 62.38,62.41 62.38,64.16 U10.5 | IC1.15 36.88,47.54 36.88,49.91 IC8.15 | 30.62,41.91 31.25,41.91 31.56,41.6 | 30.62,41.91 18.5,41.91 18.25,41.66 16.12,41.66 15.88,41.41 U5.14 | 31.56,41.6 31.75,41.41 32.75,41.41 U7.14 | 37.56,41.73 37.38,41.91 35.5,41.91 35.25,41.66 31.62,41.66 31.56,41.6 | 37.56,41.73 37.62,41.66 49.5,41.66 49.75,41.41 U8.14 | 37.56,41.73 v37.75,41.91 | v53.88,64.41 49.62,60.16 47.62,60.16 47.5,60.04 35.88,60.04 35.75,60.16 34,60.16 v33.25,59.41 | 30.62,41.91 v30.62,41.66 | v26,17.66 25.88,17.79 18.5,17.79 18.38,17.91 16.12,17.91 15.88,18.16 U4.14 | v27,18.66 27.25,18.41 v30.62,18.41 32.75,18.41 U3.14 32.88,18.41 33.12,18.66 35.25,18.66 35.5,18.91 37.5,18.91 38,18.41 49.75,18.41 U2.14 49.88,18.41 50.12,18.66 52.25,18.66 52.5,18.91 v65.5,18.91 66.25,18.91 66.75,18.41 U1.14 | v68.25,22.41 68.38,22.41 68.38,40.04 67.88,40.54 67.5,40.54 66.88,41.16 U9.14
  Bottom 0.178: v59.38,62.41 58.25,63.54 58.25,64.79 IC4.1 58.12,64.91 55.5,64.91 55.5,65.91 55.25,66.16 53.88,66.16 v53.88,64.41 | v37.75,41.91 37.75,46.66 37,47.41 IC1.15 | v33.25,59.41 31.88,58.04 31.88,55.79 30.62,54.54 v30.62,41.66 v30.62,18.41 | v27,18.66 v26,17.66 | v68.25,22.41 65.5,19.66 v65.5,18.91
D2  (via drill 0.3)
  Top 0.178: U1.15 66.75,19.66 66.25,20.16 52.5,20.16 52.12,19.79 50,19.79 49.88,19.66 U2.15 49.75,19.66 49.62,19.79 37.88,19.79 37.5,20.16 35.5,20.16 35,19.66 32.88,19.66 U3.15 32.75,19.66 32.62,19.66 32.38,19.91 21.25,19.91 v21,20.16 | v18.12,19.04 18,19.16 16.12,19.16 15.88,19.41 U4.15 | IC1.12 29.25,47.54 29.25,49.91 IC8.12 | 29.25,42.79 20.88,42.79 20.69,42.98 | 29.25,42.79 32.62,42.79 32.75,42.66 U7.15 32.88,42.66 33,42.79 35.12,42.79 35.5,43.16 37.5,43.16 37.75,42.91 48.5,42.91 48.75,42.66 49.75,42.66 U8.15 49.88,42.66 50,42.79 52.12,42.79 52.5,43.16 55,43.16 | 20.69,42.98 20.5,43.16 16.38,43.16 15.88,42.66 U5.15 | 29.25,42.79 v29.25,42.91 | v62.38,66.41 61.25,66.41 61.25,64.29 U10.6 | 55,43.16 55.12,43.16 55.38,42.91 66.5,42.91 66.75,42.66 U9.15 | v60.75,61.79 60.38,61.41 v56,61.41 | 55,43.16 v55,44.16 | 20.69,42.98 v20.88,43.16
  Bottom 0.178: v18.12,19.04 21,19.04 v21,20.16 20.88,20.29 v20.88,43.16 | v29.25,42.91 29.25,47.41 IC1.12 | v62.38,66.41 62.62,66.16 62.62,63.79 62.38,63.54 60.75,63.54 | 60.75,63.54 59.5,63.54 59.5,64.79 IC4.2 | v60.75,61.79 60.75,63.54 | v56,61.41 56.12,61.29 56.12,58.79 55.25,57.91 55.25,55.04 54.62,54.41 54.62,52.41 55.5,51.54 55.5,45.54 55,45.04 v55,44.16
D3  (via drill 0.3)
  Top 0.178: IC1.8 19.12,47.54 19.12,49.91 IC8.8 | 57.25,65.54 57.25,64.29 U10.9 | 52.88,43.54 51,43.54 50.62,43.16 48.88,43.16 48.75,43.29 38,43.29 37.5,43.79 36.5,43.79 U8.17 36.38,43.79 35.5,43.79 34.88,43.16 31.88,43.16 31.25,43.79 19.5,43.79 U7.17 19.38,43.91 18.38,43.91 v18,44.29 | 52.88,43.54 53.12,43.54 53.38,43.79 U9.17 | v54.88,65.54 57.25,65.54 | 52.88,43.54 v52.88,44.66 | 57.25,65.54 v57.25,65.79 | 4.31,22.73 4.75,23.16 v18.75,23.16 51.25,23.16 52.56,21.85 | 4.31,22.73 2.5,20.91 U4.17 | 52.56,21.85 53.5,20.91 U1.17 | v4,43.79 2.5,43.79 U5.17 | 4.31,22.73 v3.88,23.16 | 52.56,21.85 50.88,20.16 48.88,20.16 48.5,20.54 36.75,20.54 36.5,20.79 U2.17 36.38,20.79 35.5,20.79 34.88,20.16 32.75,20.16 32.62,20.29 31.88,20.29 31.38,20.79 19.62,20.79 U3.17
  Bottom 0.178: v57.25,65.79 57.62,66.16 60.62,66.16 60.62,64.91 IC4.3 | v54.88,65.54 54.5,65.16 54.5,58.79 52.5,56.79 52.5,46.16 52.88,45.79 v52.88,44.66 | IC1.8 19,47.41 18,46.41 v18,44.29 18.75,43.54 v18.75,23.16 | v4,43.79 3.88,43.66 v3.88,23.16
D4  (via drill 0.3)
  Top 0.178: 14.69,19.98 14.75,20.04 19.12,20.04 19.5,19.66 U3.18 19.62,19.54 27.12,19.54 27.62,19.04 33.88,19.04 34.12,19.29 36.12,19.29 36.38,19.54 U2.18 36.5,19.54 37.5,19.54 38,19.04 50.88,19.04 51.12,19.29 53.25,19.29 53.5,19.54 U1.18 | 14.69,19.98 14.62,19.91 2.88,19.91 U4.18 | 14.62,42.66 14.62,46.04 15.12,46.04 16.5,47.41 IC1.7 16.62,47.54 16.62,49.91 IC8.7 | 14.62,42.66 14.62,42.16 14.75,42.04 16.75,42.04 17,42.29 19.12,42.29 19.38,42.54 U7.18 19.5,42.54 19.75,42.29 31.5,42.29 31.75,42.04 35,42.04 35.5,42.54 36.38,42.54 U8.18 36.5,42.54 38.12,42.54 38.62,42.04 52.88,42.04 53.38,42.54 U9.18 53.5,42.54 56.12,42.54 v56.38,42.29 | 14.62,42.66 2.5,42.66 U5.18 | v57,53.16 57.25,53.16 57.25,54.66 U10.12 | v14.62,21.54 14.62,20.04 14.69,19.98
  Bottom 0.178: v57,53.16 57.25,52.91 57.25,50.91 57.81,50.35 | 57.81,50.35 59.38,48.79 59.38,48.29 IC3.15 | 57.81,50.35 56.38,48.91 v56.38,42.29 | v14.62,21.54 16.5,23.41 16.5,47.41 IC1.7
D5  (via drill 0.3)
  Top 0.178: U4.19 2.5,18.29 3,18.79 17.38,18.79 17.75,18.41 19.5,18.41 U3.19 19.62,18.29 21.62,18.29 | 21.62,18.29 26.38,18.29 26.88,17.79 33.88,17.79 34,17.91 36,17.91 36.38,18.29 U2.19 36.5,18.29 37.38,18.29 37.88,17.79 50.88,17.79 51.12,18.04 53.25,18.04 53.5,18.29 U1.19 | IC1.9 21.62,47.54 21.62,49.91 IC8.9 | U5.19 2.5,41.29 3,40.79 16.88,40.79 17.38,41.29 19.38,41.29 U7.19 v21.5,41.29 21.88,40.91 31.62,40.91 31.75,40.79 34.25,40.79 34.75,41.29 36.38,41.29 U8.19 36.5,41.29 37.38,41.29 37.88,40.79 53,40.79 53.38,41.16 U9.19 53.5,41.29 58.25,41.29 v58.75,41.79 | v57.88,52.66 58.38,52.16 59.25,52.16 59.75,52.66 61.12,52.66 61.12,54.66 U10.15 | v21.62,18.91 21.62,18.29
  Bottom 0.178: IC1.9 21.62,47.41 21.5,47.29 v21.5,41.29 21.62,41.16 v21.62,18.91 | IC3.1 58.12,54.29 58.12,52.91 v57.88,52.66 58,52.66 58.25,52.41 58.25,50.66 59.38,49.54 60.12,49.54 60.12,47.04 58.75,45.66 v58.75,41.79
D6  (via drill 0.3)
  Top 0.178: U4.20 2.5,17.04 3,17.54 18.12,17.54 18.25,17.41 19.25,17.41 19.5,17.16 U3.20 19.62,17.04 21.25,17.04 21.75,16.54 33.88,16.54 34,16.66 36.12,16.66 36.38,16.91 U2.20 44.5,17.04 45.12,16.41 47.88,16.41 | 47.88,16.41 50.75,16.41 51,16.66 53.12,16.66 53.5,17.04 U1.20 | IC1.10 24.25,47.54 24.25,49.91 IC8.10 | U5.20 2.5,40.04 3,39.54 18.12,39.54 18.5,39.91 19.38,39.91 U7.20 19.5,39.91 v23.62,39.91 24,39.54 31.75,39.54 31.88,39.41 34.88,39.41 35.38,39.91 36.38,39.91 U8.20 36.5,39.91 48.38,39.91 48.88,39.41 50.75,39.41 v51.25,39.91 51.38,40.04 53.38,40.04 U9.20 | 62.38,52.04 62.38,54.66 U10.16 | v60.5,52.04 62.38,52.04 | 62.38,52.04 62.5,51.91 63,51.91 63.25,51.66 63.25,48.16 55.25,48.16 v54.5,47.41 | v47.88,16.79 47.88,16.41
  Bottom 0.178: v23.62,39.91 23.62,46.91 24.12,47.41 IC1.10 | v60.5,52.04 59.5,53.04 59.5,54.29 IC3.2 | v54.5,47.41 53.5,46.41 53.5,39.79 52.5,38.79 51.25,38.79 | v51.25,39.91 51.25,38.79 | v47.88,16.79 47.88,26.29 51.25,29.66 51.25,38.79
D7  (via drill 0.3)
  Top 0.178: U4.21 2.5,15.79 3,16.29 19,16.29 19.5,15.79 U3.21 19.62,15.79 31.25,15.79 31.88,15.16 33.75,15.16 34,15.41 34.62,15.41 | 34.62,15.41 36.12,15.41 36.38,15.66 U2.21 36.5,15.66 37.5,15.66 38,15.16 50.75,15.16 51.12,15.54 53.38,15.54 53.5,15.66 U1.21 | U5.21 3,38.29 16.88,38.29 17,38.41 19.12,38.41 19.38,38.66 U7.21 19.5,38.79 31.25,38.79 31.88,38.16 34.12,38.16 v34.38,38.41 34.62,38.66 36.38,38.66 U8.21 36.5,38.66 36.75,38.41 48.62,38.41 48.88,38.16 50.75,38.16 51,38.41 53.12,38.41 53.38,38.66 U9.21 | v61.38,56.66 66.25,56.66 66.25,54.79 U10.19 | IC1.13 31.88,47.54 31.88,49.91 IC8.13 | v55.25,54.04 54.88,53.66 36.88,53.66 36.62,53.91 v35,53.91 | v34.62,15.66 34.62,15.41
  Bottom 0.178: v61.38,56.66 60.75,56.04 60.75,55.66 | 60.75,55.66 60.75,54.41 IC3.3 | IC1.13 31.88,47.41 34.38,44.91 v34.38,38.41 33.38,37.41 33.38,16.91 v34.62,15.66 | 60.75,55.66 55.62,55.66 55.62,54.41 v55.25,54.04 | v35,53.91 31.88,50.79 31.88,50.04 IC8.13
GND  (via drill 0.3)
  Top 0.6: v65.38,21.16 66.5,21.16 66.75,20.91 U1.16 | v68.25,43.79 66.88,43.79 U9.16 66.62,44.04 64.5,44.04 v64.5,44.91 | 52.25,46.54 52.25,50.04 53.5,51.29 C1.- | 52.25,46.54 57.38,46.54 58.38,47.54 63.5,47.54 64.5,48.54 v64.5,49.79 64.75,49.91 65.75,49.91 v67.12,51.29 | 32.19,21.48 32.75,20.91 U3.16 | 32.19,21.48 32,21.66 16.62,21.66 15.88,20.91 U4.16 | 43,21.66 32.38,21.66 32.19,21.48 | 43,21.66 49,21.66 49.75,20.91 U2.16 | U10.10 56,64.16 56,62.29 55.62,62.29 53.12,59.79 53.12,59.54 C2.2 52.88,59.54 v49.12,59.54 | IC1.29 29.25,62.79 29.25,65.16 IC8.29 | v30.5,57.91 20.5,57.91 | 20.5,57.91 v14,57.91 | 49.75,43.91 43.12,43.91 | 43.12,43.91 39,43.91 38.25,44.66 33.62,44.66 32.88,43.91 U7.16 32.5,43.91 31.25,45.16 20.5,45.16 | 49.75,43.91 U8.16 | 20.5,45.16 17.12,45.16 15.88,43.91 U5.16 | v20.5,56.16 20.5,57.91 | v20.5,45.41 20.5,45.16 | v43.12,44.16 43.12,43.91 | v43,22.54 43,21.66 | v51.5,46.04 51.62,46.04 52,46.41 52.25,46.54 | v50.38,44.66 49.88,44.16 49.75,43.91
  Bottom 0.6: IC4.8 67,64.79 66.62,64.41 66.62,61.66 64.75,59.79 64.75,58.91 IC4.11 64.62,58.66 64.88,58.41 64.88,57.29 67,55.16 67,54.41 IC3.8 67.12,54.04 v67.12,51.29 | v65.38,21.16 66.88,22.66 66.88,22.79 GND.1 67,23.16 68.38,24.54 68.38,43.54 v68.25,43.79 67.12,43.79 67.12,43.41 IC5.8 | v64.5,44.91 64.5,48.16 IC3.11 64.5,48.41 v64.5,49.79 | IC7.15 40.62,53.41 41.88,53.41 IC7.14 42.12,53.41 43.12,53.41 IC7.13 | IC7.13 43.25,53.66 43.62,54.04 43.62,54.66 43.88,54.91 45.62,54.91 45.62,53.66 IC7.11 45.75,53.41 46.88,53.41 IC7.10 47,53.66 47,54.16 48.25,55.41 48.25,59.41 IC7.8 48.5,59.54 v49.12,59.54 | v14,57.91 14,59.41 IC6.7 | v30.5,57.91 31.25,58.66 31.25,59.41 IC2.8 31.12,59.66 31.12,60.91 29.38,62.66 IC1.29 | v20.5,45.41 v20.5,56.16 | IC7.13 43.12,53.16 v43.12,44.16 43,43.91 v43,22.54 | v51.5,46.04 50.38,44.91 v50.38,44.66
HALT
  Top 0.178: IC1.18 44.5,49.91 IC8.18
INT
  Top 0.178: IC1.16 39.5,47.54 39.5,49.91 IC8.16
IORQ  (via drill 0.3)
  Top 0.178: IC8.20 49.62,49.91 49.62,47.54 IC1.20 49.5,47.41 46.88,44.79 39,44.79 38,45.79 28.88,45.79 v28,46.66
  Bottom 0.178: IC2.3 25,59.41 25.5,58.91 25.5,54.54 26.12,53.91 26.12,53.41 IC2.13 26.25,53.29 26.25,52.79 27.75,51.29 27.75,46.91 v28,46.66
M1
  Top 0.178: IC1.27 34.38,62.79 34.38,65.16 IC8.27
MA14  (via drill 0.3)
  Top 0.178: 29.5,27.91 17.25,27.91 16.75,27.41 15.88,27.41 U5.3 | 29.5,27.91 32.25,27.91 32.75,27.41 U7.3 | U10.3 65,64.29 65,65.54 67.88,65.54 68.12,65.29 68.12,60.91 v67.38,60.91 65.12,58.66 55.25,58.66 54.62,58.04 v50.12,58.04 | 29.69,4.85 30.12,4.41 32.75,4.41 U3.3 32.88,4.41 33.88,4.41 34.38,4.91 37.5,4.91 38.62,3.79 43.25,3.79 | 29.69,4.85 29.62,4.91 18.5,4.91 18.25,4.66 16.12,4.66 15.88,4.41 U4.3 | 43.25,3.79 49.25,3.79 49.75,4.29 U2.3 49.88,4.41 52,4.41 52.5,4.91 53.5,4.91 53.62,5.04 v64.5,5.04 66.12,5.04 66.75,4.41 U1.3 | v46.38,27.29 v47.88,27.29 49.75,27.29 U8.3 | 43.25,3.79 v43.25,4.04 | v65.25,26.91 66.38,26.91 66.75,27.29 U9.3 | v29.5,27.66 29.5,27.91 | 29.69,4.85 v29.5,4.66
  Bottom 0.178: v67.38,60.91 65.88,59.41 65.88,58.79 IC4.10 | v46.38,27.29 44.75,25.66 44.75,16.04 43.25,14.54 v43.25,4.04 | v65.25,26.91 64.5,26.16 v64.5,5.04 | v50.12,58.04 49.75,57.66 49.75,52.16 48,50.41 48,27.41 v47.88,27.29 | v29.5,4.66 v29.5,27.66
MA15  (via drill 0.3)
  Top 0.178: 9.88,2.41 18.88,2.41 19.5,3.04 U3.31 19.62,3.16 19.75,3.29 28.5,3.29 29.25,2.54 35.88,2.54 36.38,3.04 U2.31 36.5,3.04 48.12,3.04 48.62,2.54 50.88,2.54 51.25,2.91 53.38,2.91 53.5,3.04 U1.31 | 9.88,2.41 3,2.41 2.5,2.91 U4.31 | U5.31 2.5,26.04 3,25.54 v9.88,25.54 16.88,25.54 17.38,26.04 19.38,26.04 U7.31 19.5,26.04 19.75,25.79 31.5,25.79 31.75,25.54 34.62,25.54 35.12,26.04 36.38,26.04 U8.31 36.5,26.04 40.62,26.04 41.12,25.54 50.88,25.54 51.12,25.79 53.12,25.79 53.38,26.04 U9.31 53.5,26.04 54.38,26.04 54.75,25.66 v65.12,25.66 | v68.5,66.16 63.75,66.16 63.75,64.29 U10.4 | v9.88,3.16 9.88,2.41
  Bottom 0.178: v68.5,66.16 68.62,66.04 68.62,59.79 67.69,58.85 | 67.69,58.85 67.62,58.79 67.12,58.79 IC4.9 | 67.69,58.85 68.62,57.91 68.62,46.04 67.25,44.66 66.38,44.66 66.38,42.29 67.75,40.91 67.75,28.29 v65.12,25.66 | v9.88,25.54 v9.88,3.16
MA16  (via drill 0.3)
  Top 0.178: 63.75,3.66 66.25,3.66 66.75,3.16 U1.2 | 63.75,3.66 50.38,3.66 49.88,3.16 U2.2 49.75,3.16 49.5,3.41 37.75,3.41 37.5,3.66 34.38,3.66 33.88,3.16 32.88,3.16 U3.2 32.75,3.16 31.88,3.16 31.38,3.66 18.5,3.66 18.25,3.41 16.25,3.41 15.88,3.04 U4.2 | U10.7 60,64.16 60,62.79 61.5,62.79 61.88,63.16 61.88,65.54 62.75,65.54 63.12,65.16 63.12,62.66 v64.25,62.66 64.25,59.91 55.88,59.91 54.38,58.41 50.75,58.41 50.25,58.91 44.75,58.91 44.25,59.41 v38.38,59.41 | 31.56,26.35 31.75,26.16 32.75,26.16 U7.2 | 31.56,26.35 31.25,26.66 18.5,26.66 18.25,26.41 16.12,26.41 15.88,26.16 U5.2 | 49.31,26.6 49.25,26.66 35.5,26.66 35.25,26.41 34.25,26.41 | 49.31,26.6 49.75,26.16 U8.2 | 34.25,26.41 31.62,26.41 31.56,26.35 | U9.2 66.75,26.16 66.62,26.29 v63.75,26.29 54.75,26.29 54.38,26.66 49.38,26.66 49.31,26.6 | 34.25,26.41 v34.25,26.16 | v63.75,4.41 63.75,3.66
  Bottom 0.178: v64.25,62.66 65.75,64.16 65.75,64.79 IC4.7 | v38.38,59.41 35.62,56.66 35.62,27.54 v34.25,26.16 | v63.75,26.29 v63.75,4.41
MA17  (via drill 0.3)
  Top 0.178: 18.31,4.1 18.5,4.29 19.5,4.29 U3.30 | 18.31,4.1 18,3.79 3,3.79 U4.30 2.38,4.41 1.75,5.04 1.5,5.04 0.5,6.04 0.5,27.29 2.38,27.29 U5.30 2.5,27.29 3.12,26.66 8.62,26.66 8.88,26.41 14.5,26.41 14.88,26.79 18,26.79 18.5,27.29 19.38,27.29 U7.30 19.5,27.29 19.75,27.04 31.5,27.04 31.75,26.79 35,26.79 35.5,27.29 36.38,27.29 U8.30 36.5,27.41 v38,27.41 38.62,27.41 39.12,27.91 50.75,27.91 51,27.66 53.12,27.66 53.38,27.41 U9.30 53.5,27.29 54.75,27.29 v55,27.04 | U2.30 36.38,4.29 36.12,4.04 34.12,4.04 33.88,3.79 31.88,3.79 31.62,4.04 18.38,4.04 18.31,4.1 | v57.12,62.04 58.62,62.04 58.62,64.16 U10.8 | v68,60.16 66.12,58.29 56.62,58.29 v56.38,58.04 56,57.66 54.38,57.66 v53.75,57.04 | v55,4.41 53.62,4.41 U1.30 | v38.5,54.91 v53.12,54.91
  Bottom 0.178: v57.12,62.04 56.62,61.54 56.62,58.29 v56.38,58.04 | v68,60.16 68,65.66 67.5,66.16 64.62,66.16 64.62,64.91 IC4.6 | v55,27.04 v55,4.41 | v53.75,57.04 53.12,56.41 v53.12,54.91 | v38.5,54.91 37.88,54.29 37.88,47.16 38.38,46.66 38.38,36.54 37.38,35.54 37.38,28.04 v38,27.41
MA18  (via drill 0.3)
  Top 0.178: 66.5,51.91 66.5,51.54 v65.12,51.54 | 66.5,51.91 66.5,52.54 65.75,53.29 65.62,53.29 65.62,55.79 65.38,56.04 58.75,56.04 58.75,54.79 U10.13 | U2.1 49.88,1.79 50.5,1.16 66.12,1.16 66.75,1.79 U1.1 66.88,1.91 68.88,1.91 68.88,12.66 | 66.5,51.91 67.5,51.91 68.88,50.54 68.88,12.66 | 28.12,1.79 32.75,1.79 U3.1 | 28.12,1.79 27.12,1.79 26.5,1.16 16.38,1.16 15.88,1.66 U4.1 | 62.25,25.04 54.75,25.04 54.38,25.41 51.38,25.41 50.88,24.91 49.88,24.91 U8.1 49.75,24.91 49.5,25.16 40.88,25.16 40.62,25.41 35.12,25.41 34.5,24.79 32.88,24.79 U7.1 32.75,24.79 32.38,25.16 v28.12,25.16 20.62,25.16 20.38,25.41 17.38,25.41 16.88,24.91 15.88,24.91 U5.1 | 62.25,25.04 66.5,25.04 66.75,24.79 U9.1 | v28.12,2.66 28.12,1.79 | 68.88,12.66 65.88,12.66 64,14.54 v63.12,14.54 | 62.25,25.04 v62.25,24.16
  Bottom 0.178: v65.12,51.54 65.75,50.91 65.75,48.29 IC3.10 | v28.12,25.16 v28.12,2.66 | v63.12,14.54 62.12,15.54 62.12,24.04 v62.25,24.16
MA19  (via drill 0.3)
  Top 0.178: v58.88,52.79 59.12,53.04 59.88,53.04 59.88,54.66 U10.14 | v58.88,51.04 58.75,50.91 v56.62,50.91 | v55.75,44.79 59.88,44.79 60.12,45.04 60.12,46.04 | v58.12,46.04 60.12,46.04 | v65.38,46.54 65.12,46.29 60.38,46.29 60.12,46.04
  Bottom 0.178: v58.88,51.04 v58.88,52.79 | v56.62,50.91 55.88,50.16 55.88,44.91 v55.75,44.79 | v58.12,46.04 58.12,43.41 IC5.1 | v65.38,46.54 66,46.54 66.5,47.04 66.5,47.66 67,48.16 IC3.9
MA20  (via drill 0.3)
  Top 0.178: v65.88,52.16 63.75,52.16 63.75,54.66 U10.17 | v60,41.79 60.38,42.16 65,42.16 v65.38,41.79 | v65.5,44.91 65.75,44.66 67.25,44.66 68,45.41 v68,49.41
  Bottom 0.178: IC3.7 65.88,54.29 v65.88,52.16 65.88,51.54 v68,49.41 | v60,41.79 60,42.79 59.5,43.29 IC5.2 | v65.38,41.79 65.12,42.04 65.12,44.54 v65.5,44.91
MA21  (via drill 0.3)
  Top 0.178: v65.12,52.79 65,52.79 65,54.66 U10.18 | v63.25,41.54 v61.25,41.54
  Bottom 0.178: IC3.6 64.62,54.29 64.62,53.29 v65.12,52.79 65,52.79 63.88,51.66 63.88,42.16 v63.25,41.54 | v61.25,41.54 61.25,42.79 60.75,43.29 IC5.3
MREQ
  Top 0.178: IC1.19 47.12,47.54 47.12,49.91 IC8.19
N$1  (via drill 0.3)
  Top 0.178: v57.25,59.29 64.38,59.29 66.62,61.54 67.5,61.54 67.5,64.16 U10.1 | v57.25,57.54 57,57.29 55,57.29 54.12,56.41 v42.25,56.41 41.88,56.79 29.88,56.79 v28,54.91
  Bottom 0.178: v57.25,57.54 v57.25,59.29 | v42.25,56.41 40.5,58.16 39.38,58.16 39.38,59.41 IC7.1 | v28,54.91 28,53.91 27.5,53.41 IC2.12
N$2  (via drill 0.3)
  Top 0.178: v60.5,14.54 53.62,14.54 U1.22
  Bottom 0.178: v60.5,14.54 61,15.04 61,35.79 61.88,36.66 61.88,37.16 IC5.13
N$3  (via drill 0.3)
  Top 0.178: v43.88,14.16 36.75,14.16 36.5,14.41 U2.22 | v52,13.54 52.38,13.91 v59.62,13.91 | v59.88,26.91 60.88,27.91 v61.62,27.91
  Bottom 0.178: v43.88,14.16 44.75,13.29 52,13.29 v52,13.54 | v59.62,13.91 59.88,14.16 v59.88,26.91 | v61.62,27.91 62.38,28.66 62.38,33.16 63.12,33.91 63.12,37.16 IC5.12
N$4  (via drill 0.3)
  Top 0.178: v43.12,57.91 42.88,58.16 v38.5,58.16 | v36.25,53.29 55.88,53.29 57.5,51.66 59.5,51.66 59.75,51.41 62.5,51.41 v62.62,51.29
  Bottom 0.178: v43.12,57.91 43.12,59.41 IC7.4 | v38.5,58.16 36.25,55.91 v36.25,53.29 | v62.62,51.29 63.12,51.79 63.12,54.16 63.25,54.29 IC3.5 63.25,54.41 62.62,55.04 62.62,59.91 63,60.29 63,64.66 63.12,64.79 IC4.5
N$5  (via drill 0.3)
  Top 0.178: v36.75,22.54 14.62,22.54 12.38,20.29 1.25,20.29 1.25,15.41 1.5,15.16 1.75,15.16 2.38,14.54 U4.22 | v48.5,24.16 v38.38,24.16 | v59.75,35.54 v55.62,35.54
  Bottom 0.178: v38.38,24.16 v36.75,22.54 | v48.5,24.16 52,27.66 52,31.91 v55.62,35.54 | v59.75,35.54 59.5,35.79 59.5,37.16 IC5.15
N$6  (via drill 0.3)
  Top 0.178: v8,36.79 3.12,36.79 2.5,37.41 U5.22 | v59.62,33.04 v55.38,33.04
  Bottom 0.178: v8,36.79 10.5,34.29 10.5,9.29 17.38,2.41 27.5,2.41 27.5,2.29 27.75,2.04 47.25,2.04 47.25,5.16 54,11.91 54,31.66 v55.38,33.04 | v59.62,33.04 60.62,34.04 60.62,37.16 IC5.14
N$7  (via drill 0.3)
  Top 0.178: v61.75,50.79 61.25,50.29 56.12,50.29 53.75,52.66 v51.88,52.66 | v47,57.91 47.5,57.41 v50.88,57.41
  Bottom 0.178: v61.75,50.79 61.75,54.16 61.88,54.29 IC3.4 | v51.88,52.66 51.12,53.41 51.12,57.41 | 51.12,57.41 51.12,64.04 53.62,66.54 61.75,66.54 61.75,65.04 61.88,64.91 IC4.4 | v47,57.91 47,59.41 IC7.7 | 51.12,57.41 v50.88,57.41
N$8  (via drill 0.3)
  Top 0.178: v64.5,35.54 68,35.54 68,36.54 67.75,36.79 65.88,36.79 65.5,37.16 53.75,37.16 53.5,37.41 U9.22
  Bottom 0.178: v64.5,35.54 64.5,37.16 IC5.11
N$9  (via drill 0.3)
  Top 0.178: v14,55.79 14.25,55.54 v23.62,55.54
  Bottom 0.178: v14,55.79 14,53.41 IC6.8 | IC2.15 23.62,53.41 v23.62,55.54 23,56.16 23,58.79 22.38,59.41 IC2.1
N$10  (via drill 0.3)
  Top 0.178: v40.25,36.79 37.12,36.79 36.5,37.41 U8.22 | v40.25,24.79 40,25.04 38,25.04 37.75,24.79 37.75,23.54 66,23.54 66.62,24.16 67.75,24.16 68,24.41 68,31.79 v65.5,31.79
  Bottom 0.178: v40.25,24.79 v40.25,36.79 | v65.5,31.79 65.75,32.04 65.75,37.16 IC5.10
N$11  (via drill 0.3)
  Top 0.178: v27.62,36.66 26.75,37.54 19.5,37.54 U7.22 | v48.25,4.41 v46.62,4.41 | v61.62,26.91 62.62,27.91 v63.75,27.91
  Bottom 0.178: v27.62,36.66 28.88,35.41 28.88,4.29 30.12,3.04 46.62,3.04 v46.62,4.41 | v48.25,4.41 54.38,4.41 54.38,3.54 55.5,2.41 61.62,2.41 v61.62,26.91 | v63.75,27.91 67,31.16 67,37.16 IC5.9
N$12  (via drill 0.3)
  Top 0.178: v30.12,55.04 30.25,54.91 v32.88,54.91 | v33.88,53.91 35.12,52.66 43.88,52.66 v45.75,50.79 | v61.62,34.29 v56.5,34.29
  Bottom 0.178: IC4.12 63.25,58.66 63.88,58.04 63.88,53.16 63.5,52.79 63.5,48.41 63.38,48.29 IC3.12 63.25,48.16 62.62,47.54 62.62,35.29 v61.62,34.29 | v30.12,55.04 26.75,58.41 26.75,58.91 26.25,59.41 IC2.4 | v33.88,53.91 v32.88,54.91 | v45.75,50.79 46,50.54 46,28.66 47.25,27.41 47.25,16.41 47.5,16.16 52.38,16.16 52.38,31.66 55,34.29 v56.5,34.29
N$13  (via drill 0.3)
  Top 0.178: v62,45.66 62.12,45.79 63.25,45.79 | SLTSL.1 63.25,45.79 | 63.25,45.79 v63.25,45.66
  Bottom 0.178: v62,45.66 62,43.41 IC5.4 | v63.25,45.66 63.25,43.41 IC5.5
N$14  (via drill 0.3)
  Top 0.178: v30.12,14.54 19.62,14.54 U3.22 | v65.25,30.54 v56,30.54
  Bottom 0.178: v30.12,14.54 38.38,6.29 38.38,5.16 40.12,3.41 45.62,3.41 45.62,4.79 53,12.16 53.62,12.16 53.62,32.29 55,33.66 56,33.66 v56,30.54 | v65.25,30.54 66.38,31.66 66.38,41.66 66,42.04 66,43.16 65.88,43.29 IC5.7
NMI
  Top 0.178: IC1.17 42,47.54 42,49.91 IC8.17
RD  (via drill 0.3)
  Top 0.178: U4.24 3,12.41 19.12,12.41 19.5,12.04 U3.24 19.62,11.91 23.88,11.91 24.38,11.41 33.88,11.41 34.12,11.66 36.12,11.66 36.38,11.91 U2.24 36.5,11.91 37.5,11.91 38,11.41 41.38,11.41 | 41.38,11.41 50.88,11.41 51.12,11.66 53.25,11.66 53.5,11.91 U1.24 | U9.24 53.38,34.91 52.5,34.91 52,34.41 48.75,34.41 48.5,34.66 v41.38,34.66 36.75,34.66 36.5,34.91 U8.24 36.38,34.91 36.12,34.66 34.12,34.66 33.88,34.41 23.25,34.41 22.75,34.91 19.5,34.91 U7.24 19.38,34.91 18.5,34.91 18,34.41 3,34.41 2.5,34.91 U5.24 2.38,35.04 0.88,35.04 0.88,42.54 1.5,43.16 7.38,43.16 7.38,50.41 10.44,53.48 | IC8.21 49.62,65.16 49.62,62.79 IC1.21 49.5,62.66 47.25,60.41 36.12,60.41 36,60.54 19.88,60.54 17.88,58.54 9,58.54 5.75,55.29 5.75,53.54 10.38,53.54 10.44,53.48 | v24.88,54.91 23.5,53.54 10.5,53.54 10.44,53.48 | v41.38,11.66 41.38,11.41
  Bottom 0.178: v24.88,54.91 24.88,53.41 IC2.14 | v41.38,34.66 v41.38,11.66
RESET
  Top 0.178: IC1.26 36.88,62.79 36.88,65.16 IC8.26
RFSH
  Top 0.178: IC1.28 31.88,62.79 31.88,65.16 IC8.28
VCC  (via drill 0.3)
  Top 0.6: 56.12,55.79 56.12,56.66 58.12,56.66 | 56.12,55.79 56.12,54.79 U10.11 | 58.12,56.66 60.12,56.66 61,57.54 66.25,57.54 67.5,56.29 67.5,54.79 U10.20 | v58.12,56.91 58.12,56.66 | 56.12,55.79 v51.75,55.79 51.5,55.66 51.38,55.54 v39.38,55.54 | v6.38,54.91 v8.12,54.91 v10.12,54.91 10.38,54.79 11,54.16 v21.38,54.16 | v22.38,51.66 22.62,51.91 24.75,51.91 24.94,51.73 | 24.94,51.73 26.62,50.04 IC8.11 26.75,49.79 26.75,47.54 IC1.11 | v38.5,52.04 38.38,51.91 25.12,51.91 24.94,51.73 | v57.75,24.41 53.75,24.41 53.5,24.66 U9.32 | v64.5,41.29 63.25,40.04 v60.12,40.04 | v57.25,48.79 53.62,48.79 C1.+ | v1.12,2.29 1.88,2.29 2.38,1.79 U4.32 | v34.38,1.41 36,1.41 36.38,1.79 U2.32 | v21,1.79 19.62,1.79 U3.32 | v51.25,1.79 53.5,1.79 U1.32 53.75,1.91 57,1.91 v58.12,3.04 | 2.5,24.04 2.5,22.79 VCC.1 | 2.5,24.04 2.5,24.79 U5.32 | 18.94,24.23 18.75,24.04 2.5,24.04 | 18.94,24.23 19.38,24.66 U7.32 | 26.75,24.04 19.12,24.04 18.94,24.23 | 26.75,24.04 35.62,24.04 36.38,24.79 U8.32 | v26.75,24.29 26.75,24.04
  Bottom 0.6: v58.12,56.91 58.12,58.66 IC4.16 | v51.75,55.79 51.75,60.79 53,62.04 C2.1 | v6.38,54.91 6.38,53.41 IC6.14 | v8.12,54.91 8.88,54.16 8.88,53.41 IC6.12 | v10.12,54.91 10.12,53.41 IC6.11 | v22.38,51.66 22.38,53.29 IC2.16 22.12,53.41 v21.38,54.16 | v38.5,52.04 38.5,52.54 39.25,53.29 IC7.16 39.38,53.54 v39.38,55.54 | v64.5,41.29 64.5,43.29 IC5.6 | 59.69,39.6 58.38,38.29 58.38,37.41 IC5.16 58.12,37.16 58.12,24.79 v57.75,24.41 57.88,24.16 58.12,23.91 v58.12,3.04 | 59.69,39.6 v60.12,40.04 | 57.94,47.98 57.25,47.29 57.25,42.04 59.69,39.6 | 57.94,47.98 58.12,48.16 IC3.16 | v57.25,48.79 57.75,48.29 57.75,48.16 57.94,47.98 | VCC.1 2.38,22.79 2.38,3.54 v1.12,2.29 1.25,2.04 1.25,1.41 21,1.41 | 21,1.41 v34.38,1.41 47.5,1.41 47.88,1.79 v51.25,1.79 | v21,1.79 21,1.41 | v26.75,24.29 26.75,47.41 IC1.11
WAIT
  Top 0.178: IC1.24 42,62.79 42,65.16 IC8.24
WR  (via drill 0.3)
  Top 0.178: v23.75,57.04 24,57.29 40,57.29 | v45.88,57.29 40,57.29 | IC8.22 47.12,65.16 47.12,62.79 IC1.22 | 9.25,28.04 3,28.04 2.5,28.54 U5.29 | 9.25,28.04 16.75,28.04 17,28.29 19.12,28.29 19.38,28.54 U7.29 | U4.29 2.5,5.54 v9.25,5.54 14.25,5.54 14.75,5.04 18,5.04 18.5,5.54 19.5,5.54 U3.29 19.62,5.54 29.62,5.54 30.12,5.04 33.88,5.04 34.12,5.29 36.12,5.29 36.38,5.54 U2.29 36.5,5.54 37.5,5.54 38,5.04 39,5.04 | 52,5.29 51,5.29 50.75,5.04 39,5.04 | 52,5.29 53.25,5.29 53.5,5.54 U1.29 | v38,28.66 36.5,28.66 U8.29 | 39,5.04 v39,5.54 | v54.88,29.16 54,29.16 53.5,28.66 U9.29 | 52,5.29 v52,5.41 | v9.25,27.04 9.25,28.04 | v40,57.41 40,57.29
  Bottom 0.178: v23.75,57.04 23.75,59.41 IC2.2 | v45.88,57.29 46.38,57.79 46.38,62.04 47,62.66 IC1.22 | v39,5.54 39,27.66 v38,28.66 38.12,28.66 38.12,35.66 40.38,37.91 40.38,51.04 40,51.41 v40,57.41 | v54.88,29.16 54.38,28.66 54.38,7.79 v52,5.41 | v9.25,5.54 v9.25,27.04